# Altium project Motherboard refurb.PrjPcb (part 2 of 2)

## Sheet ADC.SchDoc
size A4 portrait; SheetNumber: 3; SheetTotal: 6
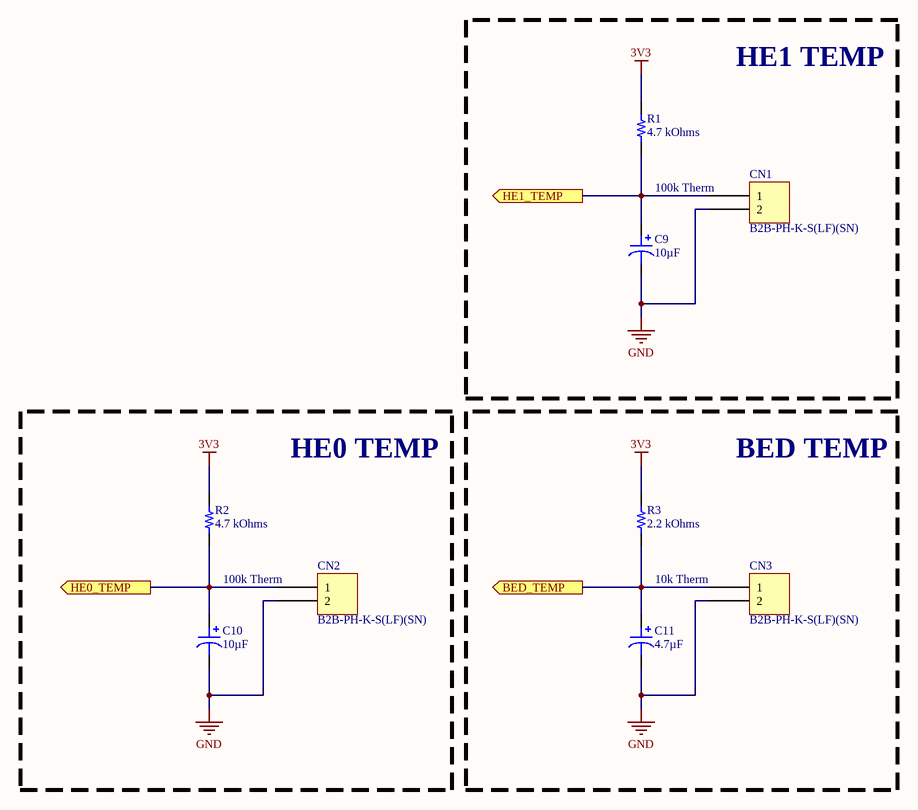
[diagram p4: ADC.SchDoc]

### Parts
C9  10µF  [CAP ALSMD 5.3MM H5.4MM]
C10  10µF  [CAP ALSMD 5.3MM H5.4MM]
C11  4.7µF  [CAP ALSMD POLY 4.3MM H5.5MM]
CN1  B2B-PH-K-S(LF)(SN)  [JST B2B-PH-K]
CN2  B2B-PH-K-S(LF)(SN)  [JST B2B-PH-K]
CN3  B2B-PH-K-S(LF)(SN)  [JST B2B-PH-K]
R1  4.7 kOhms  [RES 0603_1608]
R2  4.7 kOhms  [RES 0603_1608]
R3  2.2 kOhms  [RES 0603_1608]

### Blocks framed on the sheet
HE1 TEMP: C9 CN1 R1
HE0 TEMP: C10 CN2 R2
BED TEMP: C11 CN3 R3

### Ports
BED_TEMP (out, see Motherboard[1B], STM32F7[2A]), HE0_TEMP (out, see Motherboard[1B], STM32F7[2A]), HE1_TEMP (out, see Motherboard[1B], STM32F7[2A])

### Nets
3V3: R1.2 R2.2 R3.2
GND: C9.2 C10.2 C11.2 CN1.2 CN2.2 CN3.2
BED_TEMP: C11.1 CN3.1 R3.1 ; port BED_TEMP
HE0_TEMP: C10.1 CN2.1 R2.1 ; port HE0_TEMP
HE1_TEMP: C9.1 CN1.1 R1.1 ; port HE1_TEMP

### Notes on the sheet
- 100k Therm
- 10k Therm

### Library data of the parts
C9 C10 = UZP1C100MCL1GB: CAP ALUM 10UF 20% 16V SMD; manufacturer: Nichicon; Lifetime @ Temp.: 2000 Hrs @ 85°C; Polarization: Bi-Polar; Ripple Current @ High Frequency: 34.5mA @ 10kHz; Ripple Current @ Low Frequency: 23mA @ 120Hz; Surface Mount Land Size: 0.209" L x 0.209" W (5.30mm x 5.30mm); Part Number: UZP1C100MCL1GB; Applications: General Purpose; Capacitance: 10µF; componentlink1description: Datasheet; componentlink1url: //media.digikey.com/pdf/Data%20Sheets/Nichicon%20PDFs/ZP_Series.pdf; componentlink2description: DigiKey Link; componentlink2url: http://digikey.com/product-detail/en/nichicon/UZP1C100MCL1GB/493-10077-1-ND/3983922; Device Package: Radial, Can - SMD; Height - Seated (Max): 0.181" (4.60mm); lastupdated: 9/2/2020 1:18:30 AM; Lifecycle Status: Active; Minimum Order: 1; Mounting Type: Surface Mount; Operating Temperature: -40°C ~ 85°C; Package / Case: Radial, Can - SMD; packaging: TapeAndReel; partid: 8608; Part Status: Active; price: 0.21; series: UZP; Size / Dimension: 0.197" Dia (5.00mm); Supplier 1: DigiKey; Supplier Part Number 1: 493-10077-1-ND; Tolerance: ±20%; value: 10µF; Voltage - Rated: 16V
C11 = PCF1A4R7MCL1GB: CAP ALUM POLY 4.7UF 20% 10V SMD; manufacturer: Nichicon; ESR (Equivalent Series Resistance): 240mOhm; Lifetime @ Temp.: 2000 Hrs @ 105°C; Ripple Current @ High Frequency: 670mA @ 100kHz; Surface Mount Land Size: 0.169" L x 0.169" W (4.30mm x 4.30mm); Type: Polymer; Part Number: PCF1A4R7MCL1GB; Applications: General Purpose; Capacitance: 4.7µF; componentlink1description: Datasheet; componentlink1url: http://nichicon-us.com/english/products/pdfs/e-pcf.pdf; componentlink2description: DigiKey Link; componentlink2url: http://digikey.com/product-detail/en/nichicon/PCF1A4R7MCL1GB/493-14005-1-ND/5180801; Device Package: Radial, Can - SMD; Height - Seated (Max): 0.217" (5.50mm); lastupdated: 9/2/2020 1:22:02 AM; Lifecycle Status: Active; Minimum Order: 1; Mounting Type: Surface Mount; Operating Temperature: -55°C ~ 105°C; Package / Case: Radial, Can - SMD; packaging: TapeAndReel; partid: 1859; Part Status: Active; price: 0.36; series: PCF; Size / Dimension: 0.157" Dia (4.00mm); Supplier 1: DigiKey; Supplier Part Number 1: 493-14005-1-ND; Tolerance: ±20%; value: 4.7µF; Voltage - Rated: 10V
CN1-CN3 = B2B-PH-K-S(LF)(SN): CONN HEADER VERT 2POS 2MM; Manufacturer: JST Sales America Inc.; Contact Length - Mating: 0.130" (3.30mm); Contact Length - Post: 0.134" (3.40mm); Current Rating (Amps): 2A; Material Flammability Rating: UL94 V-0; Number of Positions: 2; Number of Positions Loaded: All; Overall Contact Length: 0.333" (8.45mm); Pitch - Mating: 0.079" (2.00mm); Shrouding: Shrouded - 4 Wall; Style: Board to Cable/Wire; Voltage Rating: 100V; Part Number: B2B-PH-K-S(LF)(SN); ComponentLink1Description: Datasheet; ComponentLink1URL: http://www.jst-mfg.com/product/pdf/eng/ePH.pdf; ComponentLink2Description: DigiKey Link; ComponentLink2URL: http://digikey.com/product-detail/en/jst-sales-america-inc/B2B-PH-K-S-LF-SN/455-1704-ND/926611; Connector Type: Header; Contact Finish - Mating: Tin; Contact Finish - Post: Tin; Contact Material: Brass; Contact Shape: Square; Contact Type: Male Pin; Fastening Type: Detent Lock; Insulation Color: Natural; Insulation Height: 0.236" (6.00mm); Insulation Material: Polyamide (PA66), Nylon 6/6; LastUpdated: 1/3/2020 11:40:58 PM; Lifecycle Status: Active; Minimum Order: 1; Mounting Type: Through Hole; Number of Rows: 1; Operating Temperature: -25°C ~ 85°C; Packaging: Bulk; PartId: 11; Part Status: Active; Price: 0.17; Series: PH; Supplier 1: DigiKey; Supplier Part Number 1: 455-1704-ND; Termination: Press-Fit, Solder
R1 R2 = RS73G1JTTD4701B: RES 4.7K OHM 0.1% 1/5W 0603; Manufacturer: KOA Speer Electronics, Inc.; Power (Watts): 0.2W, 1/5W; Temperature Coefficient: ±50ppm/°C; Part Number: RS73G1JTTD4701B; Value: 4.7 kOhms; ComponentLink1Description: Datasheet; ComponentLink1URL: http://www.koaspeer.com/pdfs/RS73.pdf; ComponentLink2Description: DigiKey Link; ComponentLink2URL: https://www.digikey.com/en/products/detail/koa-speer-electronics-inc/RS73G1JTTD4701B/11594383; Composition: Thick Film; Device Package: 0603 (1608 Metric); Features: Automotive AEC-Q200, Moisture Resistant; Height - Seated (Max): 0.022" (0.55mm); LastUpdated: 4/17/2023 7:36:04 PM; Lifecycle Status: Active; Minimum Order: 1; Number of Terminations: 2; Operating Temperature: -55°C ~ 155°C; Package / Case: 0603 (1608 Metric); Packaging: TapeAndReel; PartId: 56376; Part Status: Active; Price: 0.08; Ratings: AEC-Q200; Resistance: 4.7 kOhms; Series: RS73; Size / Dimension: 0.063" L x 0.031" W (1.60mm x 0.80mm); Supplier 1: DigiKey; Supplier Part Number 1: 2019-RS73G1JTTD4701BCT-ND; Supplier Device Package: 0603; Tolerance: ±0.1%
R3 = RS73G1JTTD2201B: RES 2.2K OHM 0.1% 1/5W 0603; Manufacturer: KOA Speer Electronics, Inc.; Power (Watts): 0.2W, 1/5W; Temperature Coefficient: ±50ppm/°C; Part Number: RS73G1JTTD2201B; Value: 2.2 kOhms; ComponentLink1Description: Datasheet; ComponentLink1URL: https://www.koaspeer.com/pdfs/RS73.pdf; ComponentLink2Description: DigiKey Link; ComponentLink2URL: https://www.digikey.com/en/products/detail/koa-speer-electronics-inc/RS73G1JTTD2201B/11592705; Composition: Thick Film; Device Package: 0603 (1608 Metric); Features: Automotive AEC-Q200, Moisture Resistant; Height - Seated (Max): 0.022" (0.55mm); LastUpdated: 4/17/2023 7:35:13 PM; Lifecycle Status: Active; Minimum Order: 1; Number of Terminations: 2; Operating Temperature: -55°C ~ 155°C; Package / Case: 0603 (1608 Metric); Packaging: TapeAndReel; PartId: 70678; Part Status: Active; Price: 0.08; Ratings: AEC-Q200; Resistance: 2.2 kOhms; Series: RS73; Size / Dimension: 0.063" L x 0.031" W (1.60mm x 0.80mm); Supplier 1: DigiKey; Supplier Part Number 1: 2019-RS73G1JTTD2201BCT-ND; Supplier Device Package: 0603; Tolerance: ±0.1%

## Sheet Misc.SchDoc
size A4; SheetNumber: 5; SheetTotal: 6
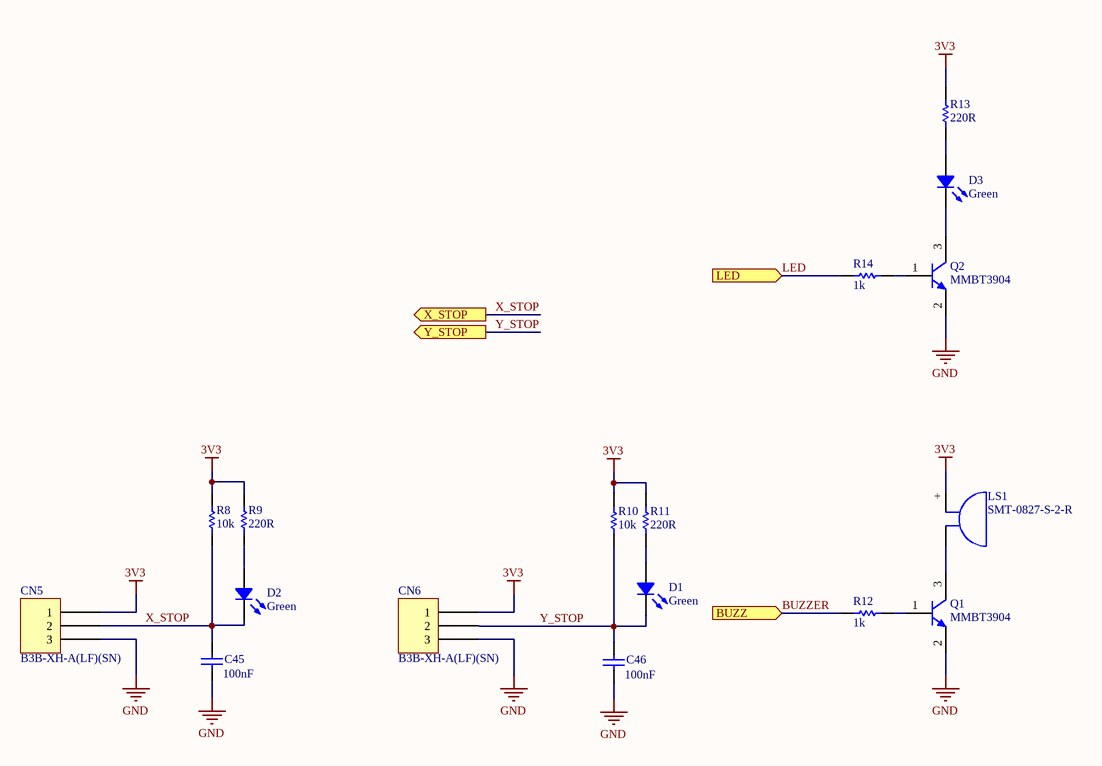
[diagram p5: Misc.SchDoc]

### Parts
C45  value 100nF  [1608[0603]]  (hidden comment: X5R)
C46  value 100nF  [1608[0603]]  (hidden comment: X5R)
CN5  B3B-XH-A(LF)(SN)  [JST XH B3B-XH-A]
CN6  B3B-XH-A(LF)(SN)  [JST XH B3B-XH-A]
D1  Green  [LED 0805_2012 GREEN]
D2  Green  [LED 0805_2012 GREEN]
D3  Green  [LED 0805_2012 GREEN]
LS1  SMT-0827-S-2-R  [PUI Audio SMT-0827-S-2-R]
Q1  MMBT3904  [SOT-23_N]
Q2  MMBT3904  [SOT-23_N]
R8  value 10k  [1608[0603]]  (hidden comment: Res1)
R9  value 220R  [1608[0603]]  (hidden comment: Res1)
R10  value 10k  [1608[0603]]  (hidden comment: Res1)
R11  value 220R  [1608[0603]]  (hidden comment: Res1)
R12  value 1k  [1608[0603]]  (hidden comment: Res1)
R13  value 220R  [1608[0603]]  (hidden comment: Res1)
R14  value 1k  [1608[0603]]  (hidden comment: Res1)

### Ports
BUZZ (in, see Motherboard[1B], STM32F7[2A]), LED (in, see Motherboard[1B], STM32F7[2A]), X_STOP (out, see Motherboard[1B], STM32F7[2A]), Y_STOP (out, see Motherboard[1B], STM32F7[2A])

### Nets
3V3: CN5.1 CN6.1 LS1.+ R8.1 R9.1 R10.1 R11.1 R13.1
GND: C45.2 C46.2 CN5.3 CN6.3 Q1.2(E) Q2.2(E)
BUZZER: R12.1 ; port BUZZ
LED: R14.1 ; port LED
X_STOP: C45.1 CN5.2 D2.2 R8.2 ; port X_STOP
Y_STOP: C46.1 CN6.2 D1.2 R10.2 ; port Y_STOP
NetD1_1: D1.1 R11.2
NetD2_1: D2.1 R9.2
NetD3_1: D3.1 R13.2
NetD3_2: D3.2 Q2.3(C)
NetLS1_-: LS1.- Q1.3(C)
NetQ1_1: Q1.1(B) R12.2
NetQ2_1: Q2.1(B) R14.2

### Library data of the parts
C45 C46 = Cap: Capacitor; Published: 8-Jun-2000; LatestRevisionDate: 17-Jul-2002; LatestRevisionNote: Re-released for DXP Platform.; PackageReference: RAD-0.3; Publisher: Altium Limited; PackageDescription: Radial Cap, Thru-Hole; 2 Leads; 0.3 in Pin Spacing
CN5 CN6 = B3B-XH-A(LF)(SN): CONN HEADER VERT 3POS 2.5MM; Manufacturer: JST Sales America Inc.; Contact Length - Post: 0.134" (3.40mm); Current Rating (Amps): 3A; Material Flammability Rating: UL94 V-0; Number of Positions: 3; Number of Positions Loaded: All; Pitch - Mating: 0.098" (2.50mm); Shrouding: Shrouded - 4 Wall; Style: Board to Cable/Wire; Voltage Rating: 250V; Part Number: B3B-XH-A(LF)(SN); ComponentLink1Description: Datasheet; ComponentLink1URL: http://www.jst-mfg.com/product/pdf/eng/eXH.pdf; ComponentLink2Description: DigiKey Link; ComponentLink2URL: http://digikey.com/product-detail/en/jst-sales-america-inc/B3B-XH-A-LF-SN/455-2248-ND/1651046; Connector Type: Header; Contact Finish - Mating: Tin; Contact Finish - Post: Tin; Contact Material: Brass; Contact Shape: Square; Contact Type: Male Pin; Fastening Type: Detent Lock; Insulation Color: Natural; Insulation Height: 0.276" (7.00mm); Insulation Material: Polyamide (PA66), Nylon 6/6; LastUpdated: 1/12/2020 11:46:22 PM; Lifecycle Status: Active; Minimum Order: 1; Mounting Type: Through Hole; Number of Rows: 1; Operating Temperature: -25°C ~ 85°C; Packaging: Bulk; PartId: 68; Part Status: Active; Price: 0.19; Series: XH; Supplier 1: DigiKey; Supplier Part Number 1: 455-2248-ND; Termination: Press-Fit, Solder
D1-D3 = QTLP630C4TR: LED GREEN CLEAR 0805 SMD; Manufacturer: Everlight Electronics Co Ltd; Configuration: Standard; Current - Test: 20mA; Lens Color: Colorless; Lens Size: 1.40mm x 1.25mm; Lens Style: Rectangle with Flat Top; Millicandela Rating: 10mcd; Viewing Angle: 140°; Voltage - Forward (Vf) (Typ): 2.1V; Wavelength - Dominant: 570nm; Wavelength - Peak: 565nm; Part Number: QTLP630C4TR; Color: Green; ComponentLink1Description: Datasheet; ComponentLink1URL: //media.digikey.com/PDF/Data%20Sheets/Everlight%20PDFs/QTLP630-2.pdf; ComponentLink2Description: DigiKey Link; ComponentLink2URL: https://www.digikey.com/en/products/detail/everlight-electronics-co-ltd/QTLP630C4TR/2675902; Device Package: 0805 (2012 Metric); Height (Max): 1.20mm; LastUpdated: 3/28/2023 7:59:32 PM; Lens Transparency: Clear; Lifecycle Status: Active; Minimum Order: 1; Mounting Type: Surface Mount; Package / Case: 0805 (2012 Metric); Packaging: TapeAndReel; PartId: 240; Part Status: Active; Price: 0.04; Series: -; Size / Dimension: 2.00mm L x 1.25mm W; Supplier 1: DigiKey; Supplier Part Number 1: 1080-1411-1-ND; Supplier Device Package: 0805; Value: Green
LS1 = SMT-0827-S-2-R: AUDIO MAGNETIC XDCR 2.5-4.5V SMD; Manufacturer: PUI Audio, Inc.; Current - Supply: 90mA; Driver Circuitry: Transducer, Externally Driven; Frequency: 2.7kHz; Input Type: Zero-Peak Signal; Operating Mode: Single Tone; Port Location: Side; Sound Pressure Level (SPL): 92dB @ 3.6V, 10cm; Voltage Range: 2.5 ~ 4.5V; Voltage - Rated: 3.6V; Part Number: SMT-0827-S-2-R; ComponentLink1Description: Datasheet; ComponentLink1URL: http://www.puiaudio.com/pdf/SMT-0827-S-2-R.pdf; ComponentLink2Description: DigiKey Link; ComponentLink2URL: http://digikey.com/product-detail/en/pui-audio-inc/SMT-0827-S-2-R/668-1072-1-ND/1464939; Height - Seated (Max): 0.177" (4.50mm); LastUpdated: 4/24/2020 12:38:09 AM; Lifecycle Status: Active; Minimum Order: 1; Mounting Type: Surface Mount; Operating Temperature: -30°C ~ 70°C; Packaging: TapeAndReel; Part Status: Active; Price: 2.03; Series: SMT; Size / Dimension: 0.335" L x 0.335" W (8.50mm x 8.50mm); Supplier 1: DigiKey; Supplier Part Number 1: 668-1072-1-ND; Technology: Magnetic; Termination: Solder Pads
Q1 Q2 = MMBT3904TT1G: TRANS NPN 40V 0.2A SOT416; Manufacturer: ON Semiconductor; Current - Collector (Ic) (Max): 200mA; DC Current Gain (hFE) (Min) @ Ic, Vce: 100 @ 10mA, 1V; Frequency - Transition: 300MHz; Power - Max: 300mW; Vce Saturation (Max) @ Ib, Ic: 300mV @ 5mA, 50mA; Part Number: MMBT3904TT1G; ComponentLink1Description: Datasheet; ComponentLink1URL: https://www.onsemi.com/pub/Collateral/MMBT3904TT1-D.PDF; ComponentLink2Description: DigiKey Link; ComponentLink2URL: http://digikey.com/product-detail/en/on-semiconductor/MMBT3904TT1G/MMBT3904TT1GOSCT-ND/1139815; LastUpdated: 2/1/2023 9:06:25 PM; Lifecycle Status: Active; Minimum Order: 1; Mounting Type: Surface Mount; Operating Temperature: -55°C ~ 150°C (TJ); Package / Case: SC-75, SOT-416; Packaging: TapeAndReel; PartId: 34; Part Status: Active; Price: 0.02; Series: -; Supplier 1: DigiKey; Supplier Part Number 1: MMBT3904TT1GOSCT-ND; Supplier Device Package: SC-75, SOT-416; Transistor Type: NPN; Voltage - Collector Emitter Breakdown (Max): 40V
R8-R14 = Res1: Resistor; Published: 8-Jun-2000; LatestRevisionDate: 17-Jul-2002; LatestRevisionNote: Re-released for DXP Platform.; PackageReference: AXIAL-0.3; Publisher: Altium Limited; PackageDescription: Axial Device, Thru-Hole; 2 Leads; 0.3 in Pin Spacing

## Nets that join several sheets
3V3: STM32F7 (36 pins), Connectors (8 pins), Memory (16 pins), ADC (R1.2 R2.2 R3.2), Misc (8 pins)
GND: STM32F7 (46 pins), Connectors (28 pins), Memory (17 pins), ADC (6 pins), Misc (6 pins)
~{CAS}: STM32F7 (IC3#1.160), Memory (IC1.17)
~{CS}: STM32F7 (IC3#1.34), Memory (IC1.19)
~{RAS}: STM32F7 (IC3#1.59), Memory (IC1.18)
~{WE}: STM32F7 (IC3#1.32), Memory (IC1.16)
BA0: STM32F7 (IC3#1.112), Memory (IC1.20)
BA1: STM32F7 (IC3#1.113), Memory (IC1.21)
BED: STM32F7 (IC3#1.26), Connectors (CN8.7)
BED_TEMP: STM32F7 (IC3#1.57), ADC (C11.1 CN3.1 R3.1)
BUZZER: STM32F7 (IC3#1.132), Misc (R12.1)
C_VSYNC: STM32F7 (IC3#1.152), Connectors (CN10.5)
CKE: STM32F7 (IC3#1.35), Memory (IC1.37)
CLK: STM32F7 (IC3#1.116), Memory (IC1.38)
CLKN: STM32F7 (IC3#2.105), Connectors (CN9.5)
CLKP: STM32F7 (IC3#2.104), Connectors (CN9.6)
CS: STM32F7 (IC3#1.79), Memory (IC2.1)
D0N: STM32F7 (IC3#2.102), Connectors (CN9.8)
D0P: STM32F7 (IC3#2.101), Connectors (CN9.9)
D1N: STM32F7 (IC3#2.108), Connectors (CN9.2)
D1P: STM32F7 (IC3#2.107), Connectors (CN9.3)
DIAG: STM32F7 (IC3#1.168), Connectors (CN8.25)
DIR1: STM32F7 (IC3#1.2), Connectors (CN8.10)
DIR2: STM32F7 (IC3#1.8), Connectors (CN8.12)
DIR3: STM32F7 (IC3#1.12), Connectors (CN8.14)
DIR4: STM32F7 (IC3#1.43), Connectors (CN8.16)
DIR5: STM32F7 (IC3#1.58), Connectors (CN8.18)
DOUT0: STM32F7 (IC3#1.124), Connectors (CN10.20)
DOUT1: STM32F7 (IC3#1.120), Connectors (CN10.19)
DOUT2: STM32F7 (IC3#1.153), Connectors (CN10.16)
DOUT3: STM32F7 (IC3#1.154), Connectors (CN10.15)
DOUT4: STM32F7 (IC3#1.3), Connectors (CN10.14)
DOUT5: STM32F7 (IC3#1.145), Connectors (CN10.13)
DOUT6: STM32F7 (IC3#1.4), Connectors (CN10.12)
DOUT7: STM32F7 (IC3#1.5), Connectors (CN10.11)
DOUT8: STM32F7 (IC3#1.133), Connectors (CN10.10)
DOUT9: STM32F7 (IC3#1.84), Connectors (CN10.9)
DQMH: STM32F7 (IC3#1.170), Memory (IC1.39)
DQML: STM32F7 (IC3#1.169), Memory (IC1.15)
E0: STM32F7 (IC3#1.115), Connectors (CN11.3)
E1: STM32F7 (IC3#1.114), Connectors (CN13.3)
ENN: STM32F7 (IC3#1.162), Connectors (CN8.24)
ENRST: STM32F7 (IC3#1.31 R7.1), Connectors (CN7.5 CN16.5)
ET_JTCK: STM32F7 (IC3#1.137), Connectors (CN7.4 CN16.2)
ET_JTMS: STM32F7 (IC3#1.128), Connectors (CN7.3 CN16.4)
ET_SWO: STM32F7 (IC3#1.161), Connectors (CN7.6 CN16.6)
FAN: STM32F7 (IC3#1.119), Connectors (CN8.2)
FHE0: STM32F7 (IC3#1.163), Connectors (CN8.3)
FHE1: STM32F7 (IC3#1.56), Connectors (CN8.4)
FS_DM_N: STM32F7 (IC3#1.126), Connectors (CN7.16)
FS_DM_P: STM32F7 (IC3#1.127), Connectors (CN7.17)
HE0: STM32F7 (IC3#1.83), Connectors (CN8.5)
HE0_TEMP: STM32F7 (IC3#1.47), ADC (C10.1 CN2.1 R2.1)
HE1: STM32F7 (IC3#1.88), Connectors (CN8.6)
HE1_TEMP: STM32F7 (IC3#1.51), ADC (C9.1 CN1.1 R1.1)
HREF: STM32F7 (IC3#1.50), Connectors (CN10.6)
LED: STM32F7 (IC3#1.134), Misc (R14.1)
NZLF: STM32F7 (IC3#1.27), Connectors (CN8.1)
PCLK: STM32F7 (IC3#1.52), Connectors (CN10.7)
PWDN: STM32F7 (IC3#1.111), Connectors (CN10.17)
RMII_CRS_DV: STM32F7 (IC3#1.53), Connectors (CN7.25)
RMII_MDC: STM32F7 (IC3#1.33), Connectors (CN7.23)
RMII_MDIO: STM32F7 (IC3#1.42), Connectors (CN7.24)
RMII_REF_CLK: STM32F7 (IC3#1.41), Connectors (CN7.22)
RMII_RXD0: STM32F7 (IC3#1.54), Connectors (CN7.27)
RMII_RXD1: STM32F7 (IC3#1.55), Connectors (CN7.26)
RMII_TX_EN: STM32F7 (IC3#1.80), Connectors (CN7.21)
RMII_TXD0: STM32F7 (IC3#1.85), Connectors (CN7.20)
RMII_TXD1: STM32F7 (IC3#1.86), Connectors (CN7.19)
S1: STM32F7 (IC3#1.175), Connectors (CN8.23)
S2: STM32F7 (IC3#1.174), Connectors (CN8.22)
S3: STM32F7 (IC3#1.173), Connectors (CN8.21)
SCL: STM32F7 (IC3#1.45), Connectors (CN10.3)
SCL1: STM32F7 (IC3#1.164), Connectors (CN9.11)
SCLK: STM32F7 (IC3#1.28), Memory (IC2.6)
SDA1: STM32F7 (IC3#1.165), Connectors (CN9.12)
SDATA: STM32F7 (IC3#1.46), Connectors (CN10.4)
SIO0: STM32F7 (IC3#1.92), Memory (IC2.5)
SIO1: STM32F7 (IC3#1.93), Memory (IC2.2)
SIO2: STM32F7 (IC3#1.1), Memory (IC2.3)
SIO3: STM32F7 (IC3#1.94), Memory (IC2.7)
SRV: STM32F7 (IC3#1.167), Connectors (CN15.3)
STEP1: STM32F7 (IC3#1.176), Connectors (CN8.9)
STEP2: STM32F7 (IC3#1.7), Connectors (CN8.11)
STEP3: STM32F7 (IC3#1.11), Connectors (CN8.13)
STEP4: STM32F7 (IC3#1.13), Connectors (CN8.15)
STEP5: STM32F7 (IC3#1.44), Connectors (CN8.17)
UART: STM32F7 (IC3#1.40), Connectors (CN8.20)
uSD_CLK: STM32F7 (IC3#1.141), Connectors (CN7.12)
uSD_CMD: STM32F7 (IC3#1.144), Connectors (CN7.11)
uSD_D0: STM32F7 (IC3#1.121), Connectors (CN7.13)
uSD_D1: STM32F7 (IC3#1.122), Connectors (CN7.14)
uSD_D2: STM32F7 (IC3#1.139), Connectors (CN7.9)
uSD_D3: STM32F7 (IC3#1.140), Connectors (CN7.10)
uSD_DETECT: STM32F7 (IC3#1.146), Connectors (CN7.8)
VCP_RX: STM32F7 (IC3#1.125), Connectors (CN7.2)
VCP_TX: STM32F7 (IC3#1.87), Connectors (CN7.1)
WIFI_RX: STM32F7 (IC3#1.138), Connectors (CN7.30)
WIFI_TX: STM32F7 (IC3#1.24), Connectors (CN7.29)
X_STOP: STM32F7 (IC3#1.157), Misc (C45.1 CN5.2 D2.2 R8.2)
XCLK: STM32F7 (IC3#1.123), Connectors (CN10.8)
Y_STOP: STM32F7 (IC3#1.156), Misc (C46.1 CN6.2 D1.2 R10.2)
Z-: STM32F7 (IC3#1.155), Connectors (CN15.5)